# EAGLE design AMG8833_REV-B (EAGLE 6.6.0)
COMPANY: ADAFRUIT INDUSTRIES; DRAWN: KTOWN; REV: A; YEAR: 2017
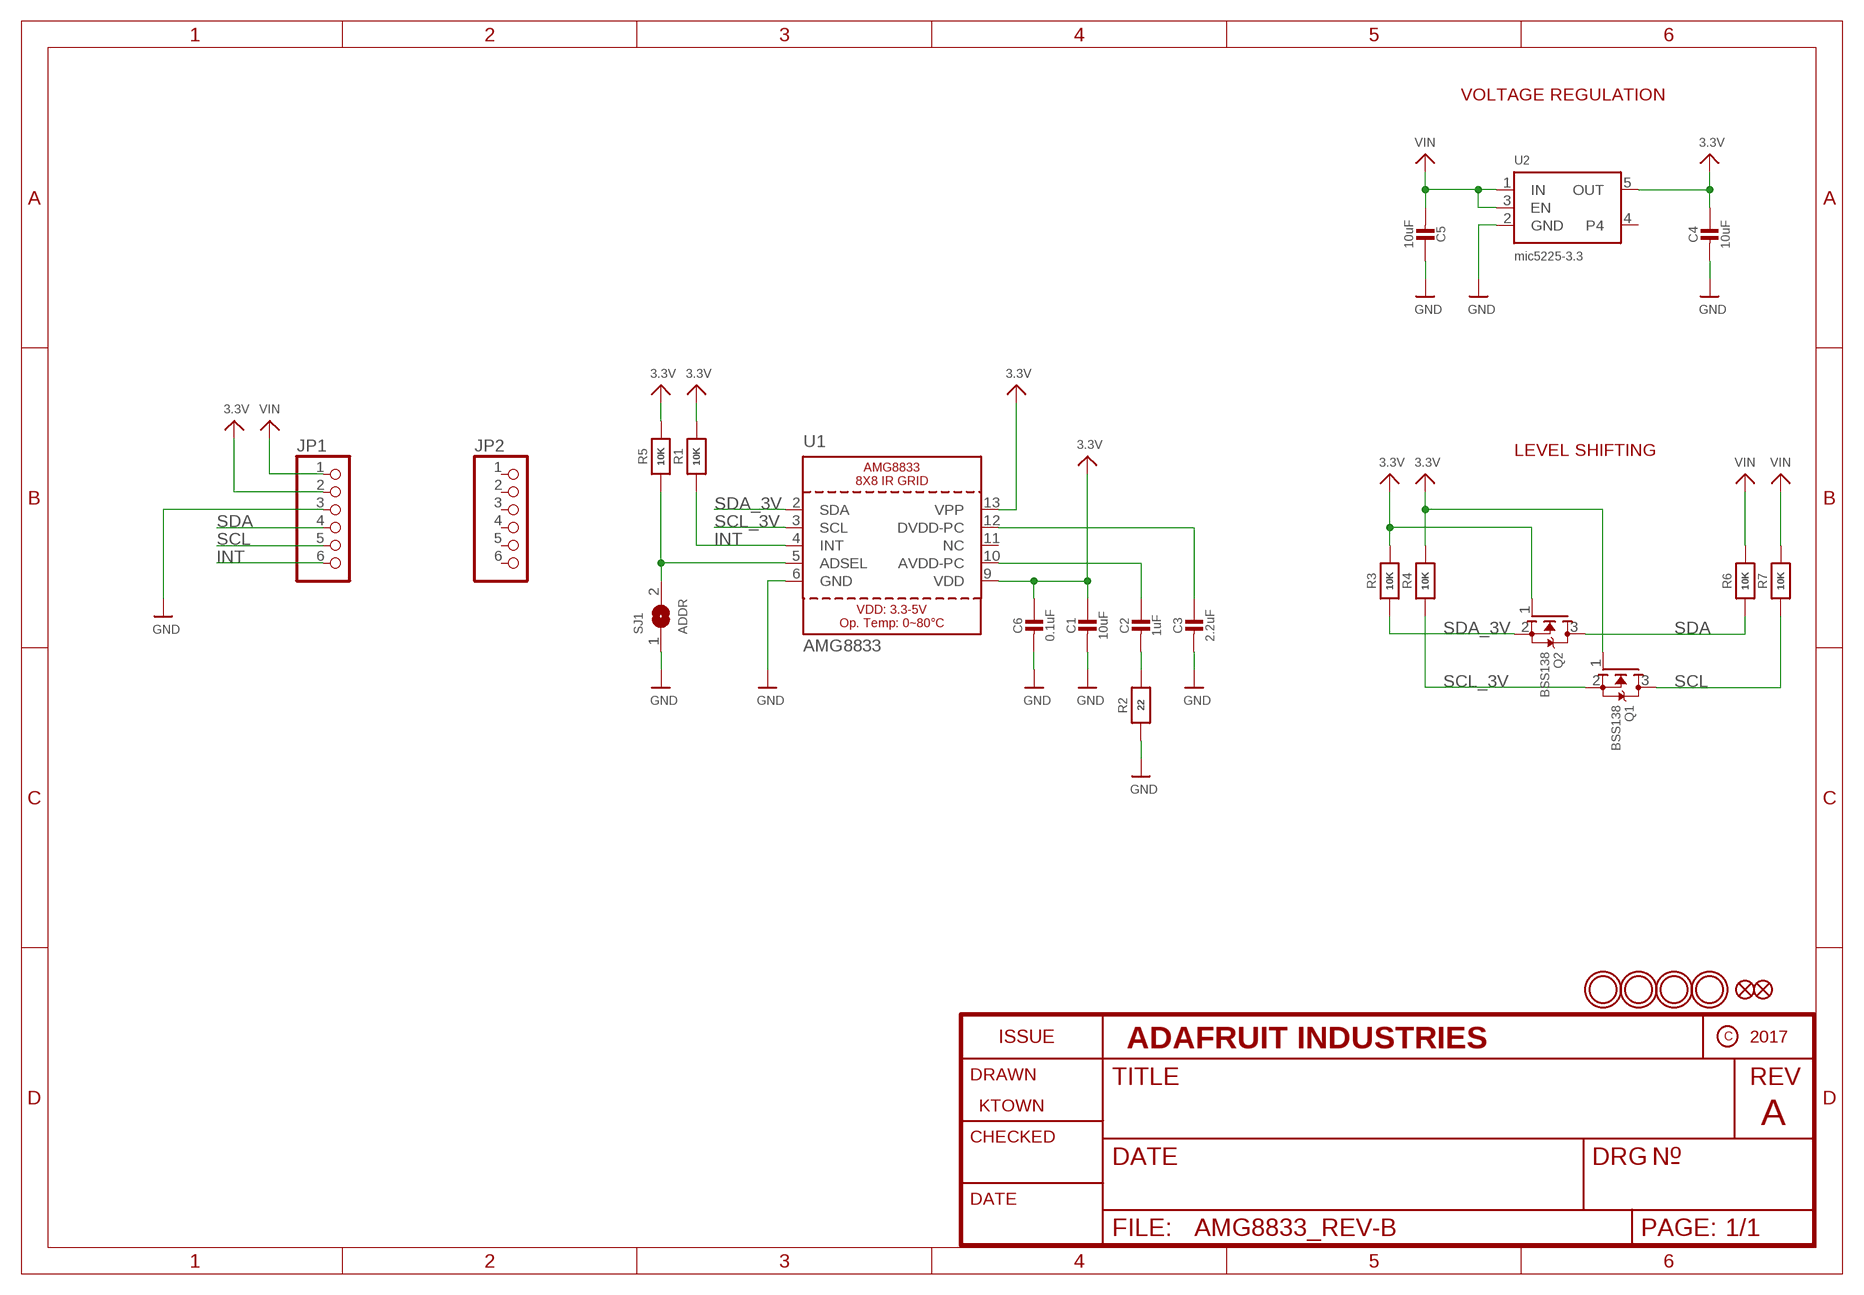
[diagram p0: schematic, sheet 1]

## Parts
C1  10uF  CAP_CERAMIC0805-NOOUTLINE  [0805-NO]
C2  1uF  CAP_CERAMIC0805-NOOUTLINE  [0805-NO]
C3  2.2uF  CAP_CERAMIC0805-NOOUTLINE  [0805-NO]
C4  10uF  CAP_CERAMIC0805-NOOUTLINE  [0805-NO]
C5  10uF  CAP_CERAMIC0805-NOOUTLINE  [0805-NO]
C6  0.1uF  CAP_CERAMIC0805-NOOUTLINE  [0805-NO]
FID2  FIDUCIAL_1MM  [FIDUCIAL_1MM]
FID3  FIDUCIAL_1MM  [FIDUCIAL_1MM]
JP1  HEADER-1X670MIL  [1X06_ROUND_70]
JP2  HEADER-1X670MIL  [1X06_ROUND_70]
Q1  BSS138  MOSFET-NWIDE  [SOT23-WIDE]
Q2  BSS138  MOSFET-NWIDE  [SOT23-WIDE]
R1  10K  RESISTOR0805_NOOUTLINE  [0805-NO]
R2  22  RESISTOR0805_NOOUTLINE  [0805-NO]
R3  10K  RESISTOR0805_NOOUTLINE  [0805-NO]
R4  10K  RESISTOR0805_NOOUTLINE  [0805-NO]
R5  10K  RESISTOR0805_NOOUTLINE  [0805-NO]
R6  10K  RESISTOR0805_10MGAP  [0805_10MGAP]
R7  10K  RESISTOR0805_10MGAP  [0805_10MGAP]
SJ1  ADDR  SOLDERJUMPER  [SOLDERJUMPER_ARROW_NOPASTE]
U1  AMG8833  [AMG8833]
U2  mic5225-3.3  VREG_SOT23-5  [SOT23-5]
U$16  MOUNTINGHOLE2.5  [MOUNTINGHOLE_2.5_PLATED]
U$17  MOUNTINGHOLE2.5  [MOUNTINGHOLE_2.5_PLATED]
U$18  MOUNTINGHOLE2.5  [MOUNTINGHOLE_2.5_PLATED]
U$19  MOUNTINGHOLE2.5  [MOUNTINGHOLE_2.5_PLATED]

## Nets
3.3V: C1.1 C4.1 C6.1 JP1.2 Q1.1(G) Q2.1(G) R1.2 R3.2 R4.2 R5.2 U1.9(VDD) U1.13(VPP) U2.5(OUT)
AVDD-PC: C2.1 U1.10(AVDD-PC)
DVDD-PC: C3.1 U1.12(DVDD-PC)
GND: C1.2 C3.2 C4.2 C5.1 C6.2 JP1.3 R2.1 SJ1.1 U1.6(GND) U2.2(GND)
INT: JP1.6 R1.1 U1.4(INT)
N$2: R5.1 SJ1.2 U1.5(ADSEL)
N$4: C2.2 R2.2
SCL: JP1.5 Q1.3(D) R7.1
SCL_3V: Q1.2(S) R4.1 U1.3(SCL)
SDA: JP1.4 Q2.3(D) R6.1
SDA_3V: Q2.2(S) R3.1 U1.2(SDA)
VIN: C5.2 JP1.1 R6.2 R7.2 U2.1(IN) U2.3(EN)
Unconnected: JP2.1 JP2.2 JP2.3 JP2.4 JP2.5 JP2.6 U1.11(NC) U2.4

## Notes on the sheet
- VOLTAGE REGULATION
- LEVEL SHIFTING

## Library data of the parts
C1-C6 = microbuilder:CAP_CERAMIC: Ceramic Capacitors For new designs, use the packages preceded by an '_' character since they are more reliable: The following footprints should be used on most boards: _0402 - Standard footprint for regular board layouts _0603 - Standard footprint for regular board layouts _0805 - Standard footprint for regular board layouts _1206 - Standard footprint for regular board layouts For extremely tight-pitch boards where space is at a premium, the following 'micro-pitch' footprints can be used (smaller pads, no silkscreen outline, etc.): _0402MP - Micro-pitch footprint for very dense/compact boards _0603MP - Micro-pitch footprint for very dense/compact boards _0805MP - Micro-pitch footprint for very dense/compact boards _1206MP - Micro-pitch footprint for very dense/compact boards
FID2 FID3 = microbuilder:FIDUCIAL: Fiducial Alignment Points Various fiducial points for machine vision alignment.; BOM: EXCLUDE
JP1 JP2 = microbuilder:HEADER-1X6: PIN HEADER
Q1 Q2 = microbuilder:MOSFET-N: N-Channel Mosfet LEGEND VDS: Voltage Drain-Source ID: Drain Current RDS(ON): Drain-Source On-State Resistance VGS(TH): Gate-Source Threshold Voltage CISS: Drain-Source Input Capacitance SOT-23 Name VDS ID RDS(ON) VGS(TH) CISS Order Number 2N7002E 60V 260mA 2.5 Ohm 2.5V @ 250uA 26.7pF @ 25V 2N7002ET1GOSTR-ND BSH103 30V 850mA 400 mOhm 400mV @ 1mA 83pF @ 24V BSH103,235-ND BSS138 60V 320mA 1.6 Ohm 1.5V @ 250uA 50pF @ 10V Mouser: 771-BSS138PW115 DMN2075U-7 20V 4.2A 38 mOhm 1V @ 250 uA 594.3pF @ 10V DMN2075U-7DICT-ND * BSS138 good choice for I2C level-shifting POWERPAK 1212-8 Name VDS ID RDS(ON) VGS(TH) CISS Order Number Si7308DN 60V 6A 58 mOhm 3V @ 250uA 665pF @ 15V SI7308DN-T1-E3CT-ND
R1-R7 = microbuilder:RESISTOR: Resistors For new designs, use the packages preceded by an '_' character since they are more reliable: The following footprints should be used on most boards: _0402 - Standard footprint for regular board layouts _0603 - Standard footprint for regular board layouts _0805 - Standard footprint for regular board layouts _1206 - Standard footprint for regular board layouts For extremely tight-pitch boards where space is at a premium, the following 'micro-pitch' footprints can be used (smaller pads, no silkscreen outline, etc.): _0402MP - Micro-pitch footprint for very dense/compact boards _0603MP - Micro-pitch footprint for very dense/compact boards _0805MP - Micro-pitch footprint for very dense/compact boards _1206MP - Micro-pitch footprint for very dense/compact boards
SJ1 = microbuilder:SOLDERJUMPER: SMD Solder JUMPER Solder the two pads together to create a connection, or remove the solder to break it. REFLOW - Use this footprint for solder paste and reflow ovens. WAVE - Use this footprint for hand-soldering (larger pads). CLOSED - Has a trace between the two pads to ensure it is closed by default. The trace needs to be cut to disable the jumper, and can be closed again by creating a solder bridge between the two pads.; BOM: EXCLUDE
U1 = microbuilder:AMG8833: AMG8833 8x8 IR Grid Sensor Viewing Angle: ~60° Temp Accuracy: +/-2-3°C (high/low gain)
U2 = microbuilder:VREG_SOT23-5: SOT23-5 Fixed Voltage Regulators Part Current Out V Out V In V Dropout θJA (°C/W) TJ (°C) Digikey Part No. ADP121 150mA 3.3V 3.4-5.5V 0.09V @ 150mA -- -- ADP121-AUJZ33R7CT-ND ADP121 150mA 3.0V 3.1-5.5V 0.09V @ 150mA -- -- ADP121-AUJZ30R7CT-ND ADP122 300mA 3.3V 3.4-5.5V 0.085V @ 300mA -- -- ADP122AUJZ-3.3-R7CT-ND ADP1712 300mA 3.3V 3.5-5.5V 0.17V @ 300mA -- -- ADP1712AUJZ-3.3-R7TR-ND AP7311 (Low Cost) 150mA 3.3V 3.5-6V 0.15V @ 150mA -- -- AP7311-33WG-7DICT-ND LD39015M18R 150mA 1.8V 1.9V-5.5V 0.08V @ 100mA -- -- 497-6977-1-ND LP2985A-33DBVR 150mA 3.3V 3.3-16V 0.28V @ 150mA 206 150 296-18479-1-ND MCP1824T-3302E/OT 300mA 3.3V 3.5V-6V 0.2V @ 300mA -- -- MCP1824T-3302E/OTCT-ND MIC5205-2.5YM5 TR 150mA 2.5V 2.7-16V 0.165V @ 150mA -- -- 576-1257-2-ND MIC5205-3.0YM5 TR 150mA 3.0V 3.2V-16V 0.165V @ 150mA -- -- 576-1258-2-ND MIC5205-3.3YM5 TR 150mA 3.3V 3.5V-16V 0.165V @ 150mA -- -- 576-1259-2-ND TPS780330220 150mA 3.3V+2.2V 3.6-5.5V 250mV Max -- -- 296-23332-1-ND TDA3663/N1,135 100mA 3.3V 3.5-45V 0.18V @ 50mA -- -- 568-5343-1-ND Max operating temp can be calculated using θJA, TJ (max junction temperature), and power in watts. Set the "Maximum Ambient Temperature" until it reaches TJ ("Max Junction Temperature"), which is the absolute limit for safe use of the regulator: Heat Sink Temperature Calculator <http://www.daycounter.com/Calculators/Heat-Sink-Temperature-Calculator.phtml> For example, With 12V source into a 3.3V LP2985 and a 30mA load, we are dissipating (12V-3.3V) * 0.03A = 0.261W. With a θJA of 206 °C/W, a TJ of 150°C, and 261mW we can safely use the chip without a heat sink up to 75°C (=147.1°C Junction Temperature).
U$16-U$19 = microbuilder:MOUNTINGHOLE: Mounting Hole For #2 screws (0.086"/2.18mm width, 0.094"/2.4mm hole) use 2.5mm; BOM: EXCLUDE

## Board
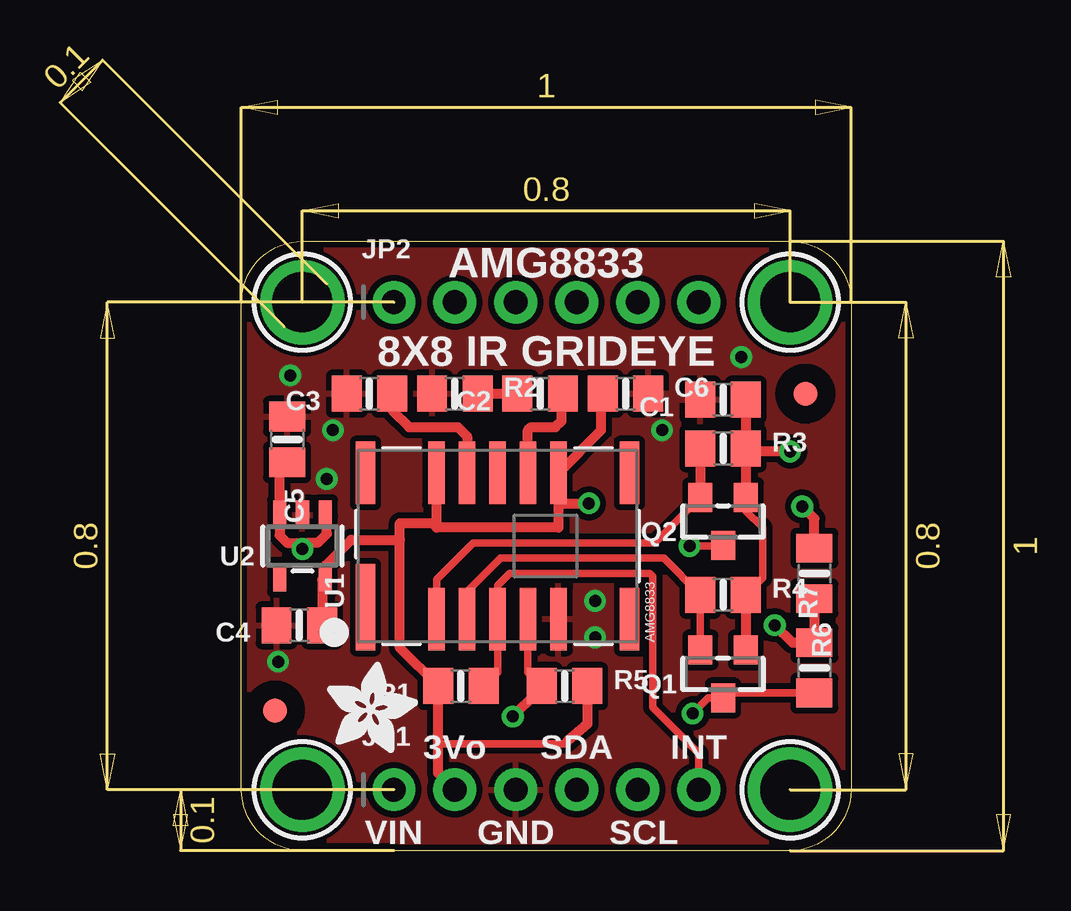
[diagram p1: board, top side]
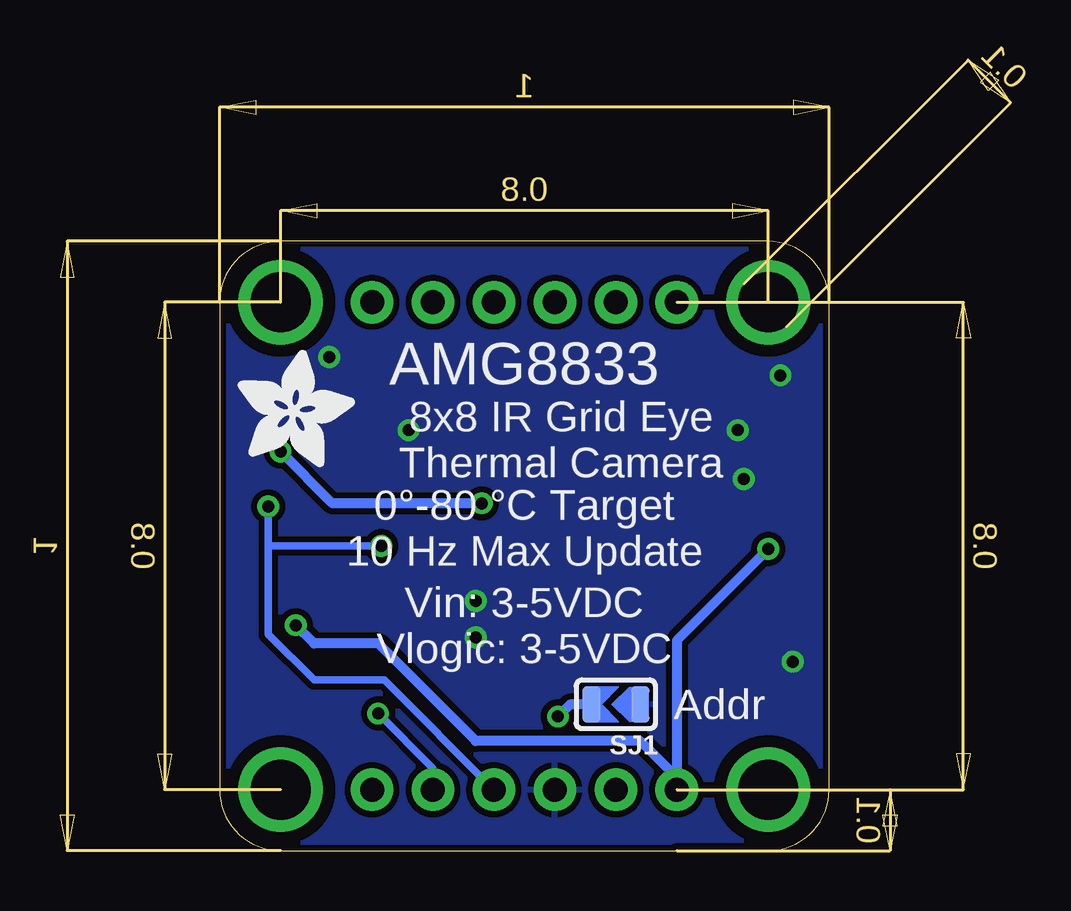
[diagram p2: board, bottom side, seen from below]

Size 25.4 x 25.4 mm. Coordinates in mm from the lower left corner, seen from the top.
Outline: 0,2.54 0,22.86 arc-90 2.54,25.4 22.86,25.4 arc-90 25.4,22.86 25.4,2.54 arc-90 22.86,0 2.54,0 arc-90 0,2.54
Copper layers (1*16): Top 0.035mm / dielectric 1.5mm / Bottom 0.035mm
Design rules "adafruit": minimum track width 8mil, minimum drill 15.5mil, track to track 8mil, track to pad 8mil, pad to pad 8mil, via to via 8mil, smd to smd 8mil, copper to edge 10mil, drill to drill 8mil, minimum pad ring 10mil, minimum via ring 8mil, stop-mask expansion 2mil, vias tented up to drill 20mil, thermal gap 10mil

### Footprints (pad centres in the part's own frame; a part is rotated, then mirrored left to right if it is on the bottom)
0805-NO = smd 1.24 x 1.5: 1 -0.95,0; 2 0.95,0
FIDUCIAL_1MM = smd 1 x 1: 1 0,0
1X06_ROUND_70 = drill 1 pad 1.778: 1 -6.35,0; 2 -3.81,0; 3 -1.27,0; 4 1.27,0; 5 3.81,0; 6 6.35,0
SOT23-WIDE = smd 1 x 1.2: 1 -0.95,-1; 2 0.95,-1; 3 0,1
0805_10MGAP = smd 1.2 x 1.5: 1 -1.05,0; 2 1.05,0
SOLDERJUMPER_ARROW_NOPASTE = smd 0.762 x 1.524: 1 -1.016,0; 2 1.016,0
AMG8833 = smd 0.8 x 3.6: 1 -5.5,-2.55 | smd 0.7 x 2.6: 2 -2.54,-3.05; 3 -1.27,-3.05; 4 0,-3.05; 5 1.27,-3.05; 6 2.54,-3.05; 9 2.54,3.05; 10 1.27,3.05; 11 0,3.05; 12 -1.27,3.05; 13 -2.54,3.05 | smd 0.8 x 2.6: 7 5.5,-3.05; 8 5.5,3.05; 14 -5.5,3.05
SOT23-5 = smd 0.55 x 1.2: 1 -0.95,-1.3; 2 0,-1.3; 3 0.95,-1.3; 4 0.95,1.3; 5 -0.95,1.3
MOUNTINGHOLE_2.5_PLATED = drill 2.5 pad 3.2: P$1 0,0

### Placement (x,y rotation side)
C1  20.07,18.8 180 top
C2  12.45,19.05 180 top
C3  5.33,19.05 180 top
C4  2.41,9.4 180 top
C5  1.91,17.14 270 top
C6  16,19.05 0 top
FID2  23.5,19.05 0 top
FID3  1.4,5.84 0 top
JP1  12.7,2.54 0 top
JP2  12.7,22.86 0 top
Q1  20.07,7.37 180 top
Q2  20.07,13.72 180 top
R1  9.14,6.86 180 top
R2  8.89,19.05 0 top
R3  20.07,16.76 0 top
R4  20.07,10.67 0 top
R5  13.46,6.86 0 top
R6  23.88,11.56 270 top
R7  23.88,7.62 90 top
SJ1  8.89,6.1 180 bottom
U1  10.67,12.7 0 top
U2  2.54,12.7 180 top
U$16  22.86,2.54 0 top
U$17  2.54,22.86 0 top
U$18  22.86,22.86 0 top
U$19  2.54,2.54 0 top
U$21  [ADAFRUIT_3.5MM]  3.56,4.06 0 top
U$28  [ADAFRUIT_5MM]  24.64,16 0 bottom

### Tracks (layer width: path | path; a pad name or v marks a point on that pad's centre or on a via)
3.3V  (via drill 0.5)
  Top 0.305: Q2.1 21.02,14.16 21.72,13.46 21.72,11.37 R4.2 | 13.59,4.57 13.46,4.45 8.19,4.45
  Top 0.406: 13.21,14.48 U1.9 14.99,17.53 14.99,18.73 C6.1 14.99,18.86 | 13.21,14.48 13.21,13.46 8.13,13.46 | 8.13,13.46 U1.13 | 8.13,13.46 7.94,13.65 6.6,13.65 6.6,12.95 | JP1.2 8.19,3.24 8.19,4.45 R1.2 6.6,8.45 6.6,12.95 | 20.95,18.86 C1.1 R3.2 21.02,16.26 | 21.02,16.26 Q2.1 | R4.2 Q1.1 | R5.2 14.41,5.27 13.59,4.57 | 13.21,14.48 v14.48,14.48 | v22.86,16.64 21.4,16.64 21.02,16.26 | 6.6,12.95 4.57,12.95 3.49,11.87 U2.5 3.36,11.27 C4.1
  Bottom 0.406: v14.48,14.48 20.7,14.48 v22.86,16.64
AVDD-PC
  Top 0.406: U1.10 11.94,17.53 12.06,17.65 13.08,17.65 13.34,17.91 13.34,18.99 C2.1
DVDD-PC
  Top 0.406: C3.1 6.28,18.35 6.99,17.65 9.02,17.65 9.4,17.27 U1.12
GND  (via drill 0.5)
  other vias: 2.03,19.81 14.73,8.89 1.52,7.87 3.56,15.49 3.81,17.53 14.73,10.41 17.53,17.53 20.83,20.57
  pour Bottom (isolate 0.254): 0.13,25.78 25.53,25.78 25.4,0 0,0
  pour Top (isolate 0.254): 0.13,25.78 25.53,25.78 25.4,0 0,0
INT
  Top 0.305: R1.1 10.67,7.43 U1.4 10.67,11.05 11.18,11.56 17.02,11.56 17.14,11.43 17.14,5.97 19.05,4.06 JP1.6
N$2  (via drill 0.5)
  Top 0.305: U1.5 11.94,7.43 R5.1 12.51,6.54
  Top 0.406: 12.51,6.54 12.26,6.54 v11.3,5.59
  Bottom 0.406: SJ1.2 10.79,6.1 v11.3,5.59
N$4
  Top 0.406: R2.2 C2.2
SCL  (via drill 0.5)
  Top 0.305: R7.1 20.27,6.57 Q1.3 19.45,6.37 v18.8,5.71
  Bottom 0.305: JP1.5 16.51,3.43 v18.8,5.71
SCL_3V
  Top 0.305: Q1.2 R4.1 17.59,12.19 10.79,12.19 9.4,10.79 U1.3
SDA  (via drill 0.5)
  Top 0.305: 23.62,14.1 v23.37,14.35 | Q2.3 20.05,12.7 v18.67,12.7
  Top 0.406: R6.1 23.88,13.84 v23.37,14.35
  Bottom 0.305: v23.37,14.35 23.37,12.7 | 23.37,12.7 23.37,9.02 21.46,7.11 18.54,7.11 JP1.4 | v18.67,12.7 23.37,12.7
SDA_3V
  Top 0.305: U1.2 8.13,11.3 9.65,12.83 17.23,12.83 Q2.2
  Top 0.406: R3.1 Q2.2
VIN  (via drill 0.5)
  Top 0.406: v22.23,9.4 22.95,8.67 R7.2 R6.2 | 2.79,12.83 1.91,12.83 1.59,13.14 U2.3 1.59,15.88 C5.2 | U2.1 3.56,13.93 3.56,13.21 3.17,12.83 2.79,12.83 | 2.79,12.83 v2.54,12.57
  Bottom 0.406: v22.23,9.4 21.46,8.64 18.8,8.64 14.73,4.57 7.87,4.57 6.35,3.05 JP1.1 6.35,8.76 v2.54,12.57

### Text on the board
tPlace: AMG8833 | 8X8 IR GRIDEYE | 3Vo | SDA | INT | VIN | GND | SCL
bPlace: AMG8833 | 8x8 IR Grid Eye / Thermal Camera | 0°-80 °C Target / 10 Hz Max Update | Vin: 3-5VDC / Vlogic: 3-5VDC | Addr
tValues: AMG8833